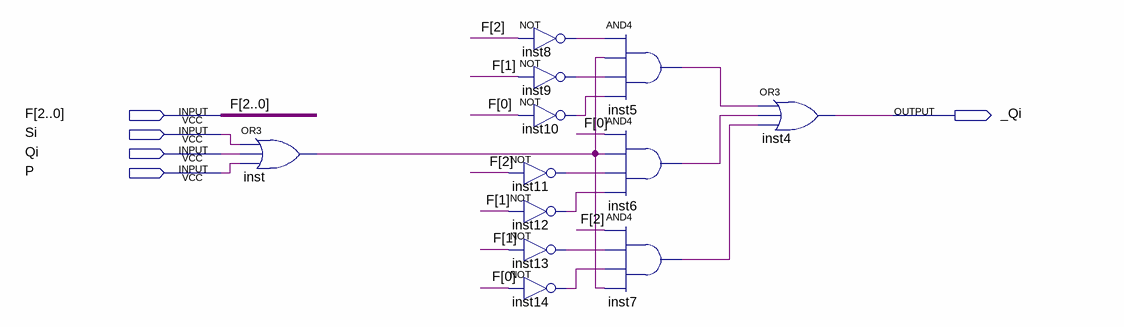
[diagram p0: schematic sheet]
// Quartus schematic FP.bdf as structural Verilog: 12 symbols, 5 pins
module FP (
  input  [2:0] F,
  input  Si,
  input  Qi,
  input  P,
  output _Qi
);

  wire inst5_out, inst6_out, inst7_out, inst8_out, inst9_out, inst10_out, inst11_out, inst12_out, inst13_out,
       inst14_out, inst_out;

  or inst (inst_out, Si, Qi, P);
  not inst8 (inst8_out, F[2]);
  not inst9 (inst9_out, F[1]);
  not inst10 (inst10_out, F[0]);
  not inst11 (inst11_out, F[2]);
  not inst12 (inst12_out, F[1]);
  not inst13 (inst13_out, F[1]);
  not inst14 (inst14_out, F[0]);
  and inst5 (inst5_out, inst8_out, inst_out, inst9_out, inst10_out);
  and inst6 (inst6_out, F[0], inst_out, inst11_out, inst12_out);
  and inst7 (inst7_out, F[2], inst13_out, inst14_out, inst_out);
  or inst4 (_Qi, inst5_out, inst6_out, inst7_out);
endmodule
